# Altium schematic sheet Main.SchDoc
size A4
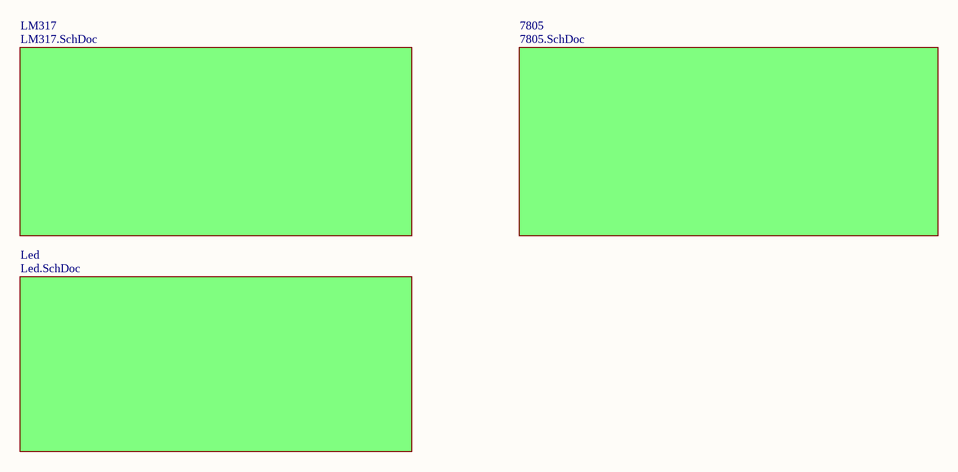
[diagram p0: Main.SchDoc]

## Sub-sheets
7805 = 7805.SchDoc: no entries
Led = Led.SchDoc: no entries
LM317 = LM317.SchDoc: no entries